# Altium project UZİNOVA_İSRA.PrjPcb
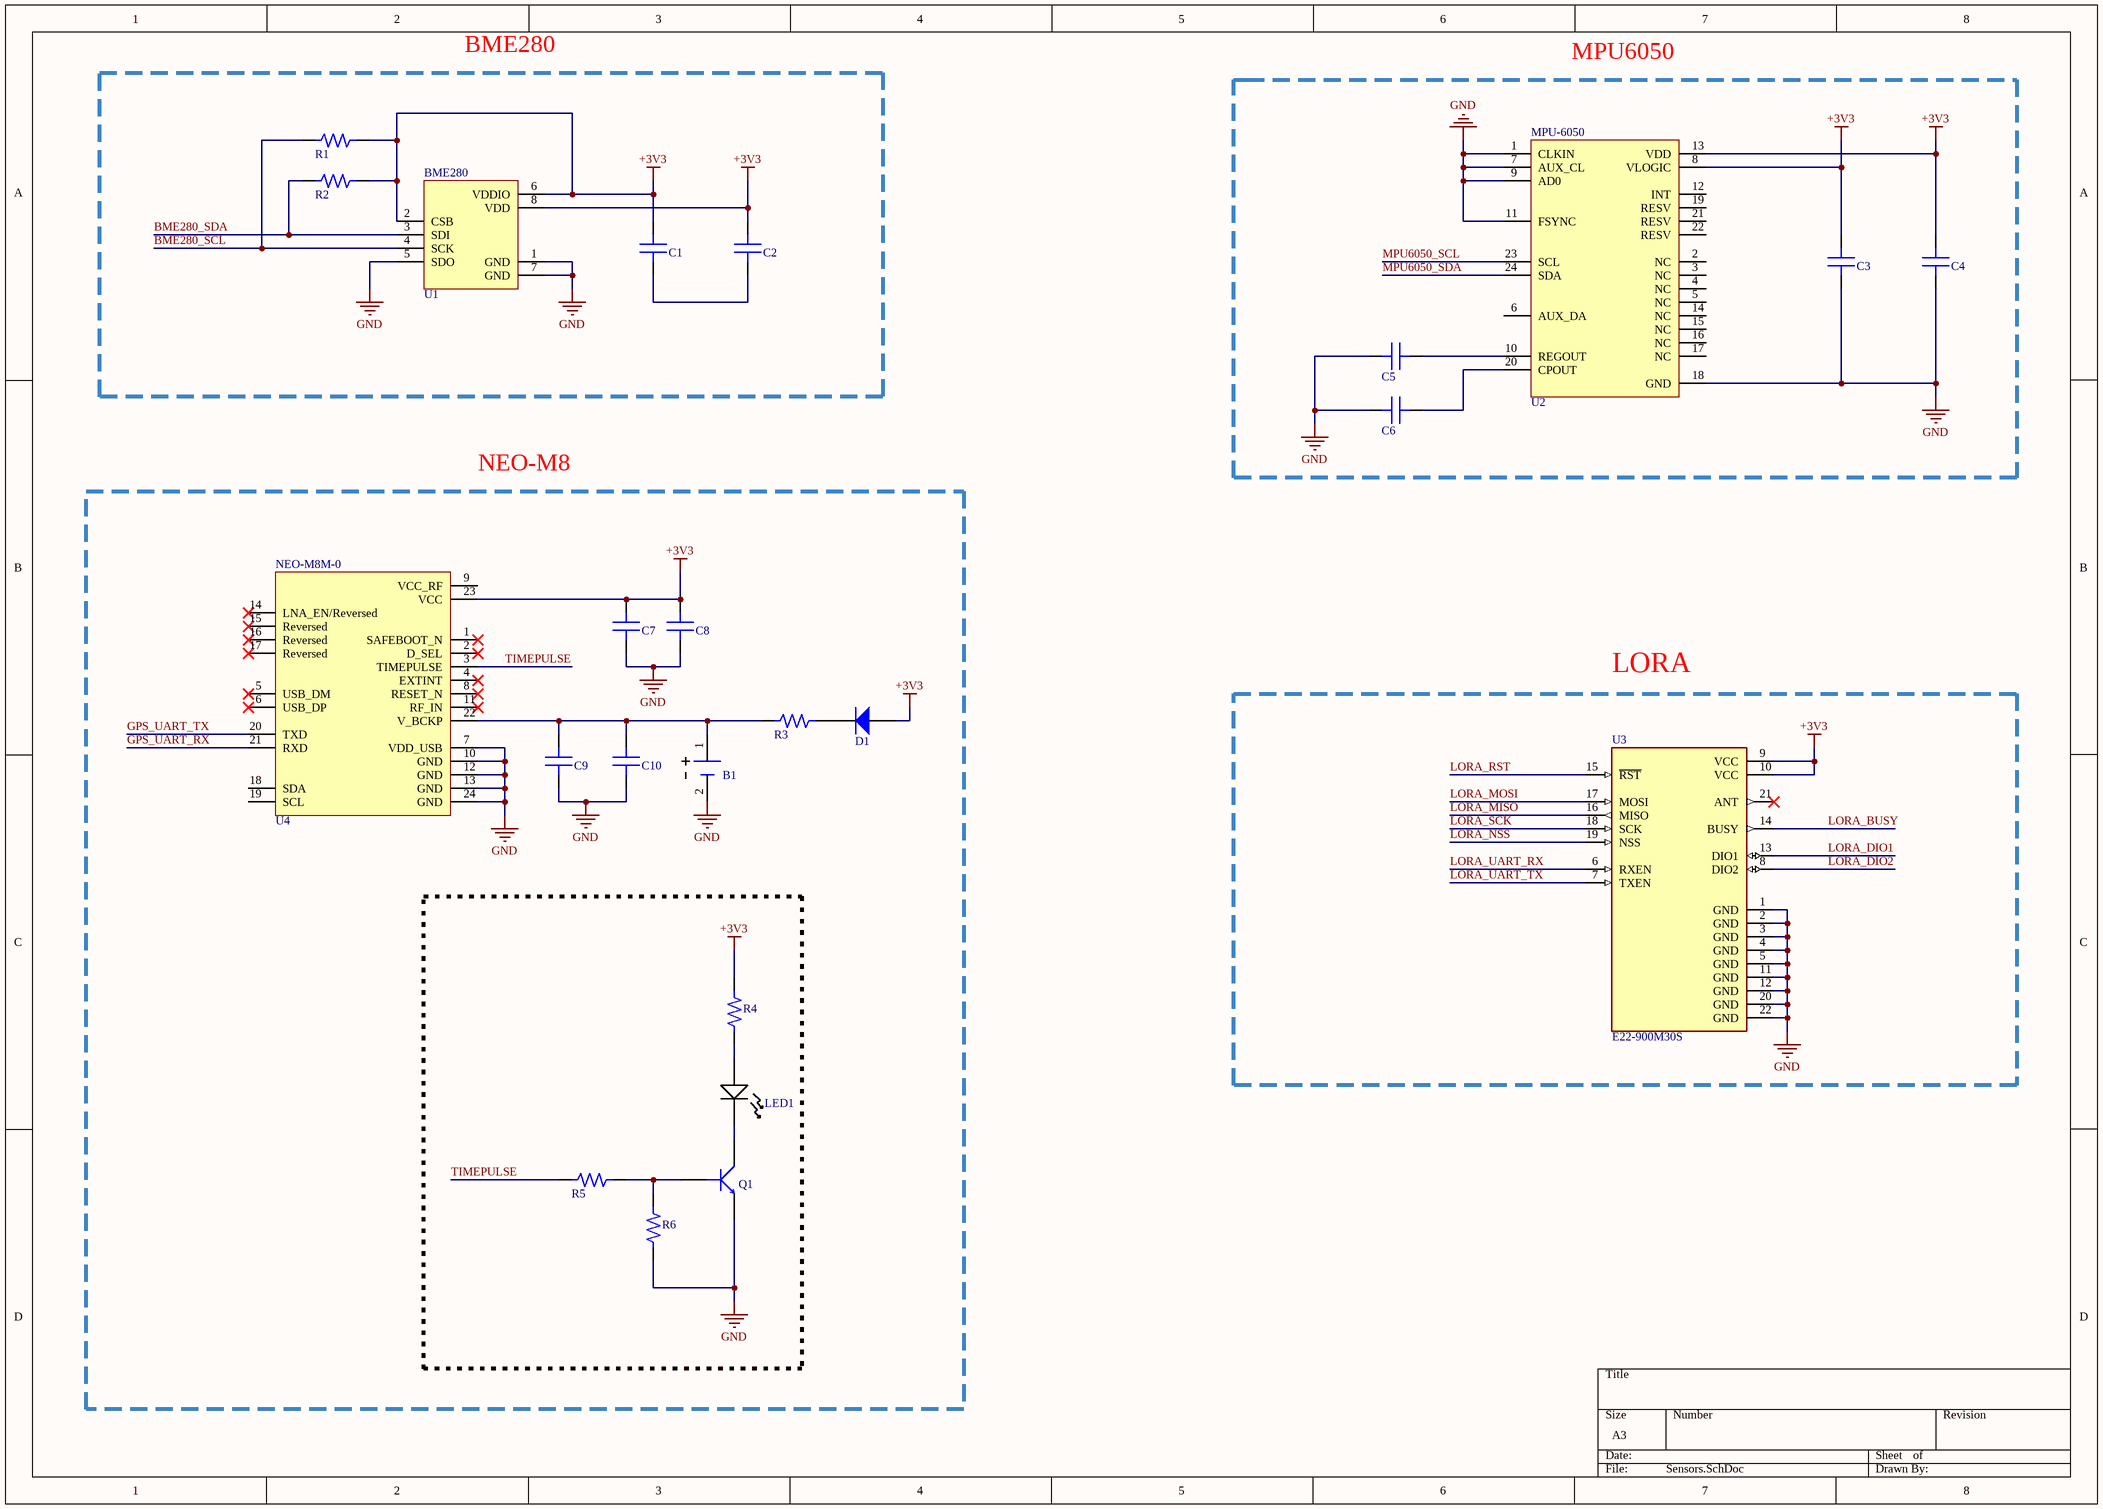
[diagram p0: Sensors.SchDoc]
3 sheets, 80 parts. Net scope: global (net labels, ports and power ports of the same name join across sheets).
Board file: İSRA.PcbDoc
Sheets:
  Sensors.SchDoc
  Mcu.SchDoc
  Power.SchDoc

## Sheet Sensors.SchDoc
size A3; SheetNumber: 1; SheetTotal: 3

### Parts
B1  MS920SE-FL27E  [MS920SE_Battery]  (value not drawn)
C1  CAP CER 100nF 0805  [CAP_0805]  (value not drawn)
C2  CAP CER 100nF 0805  [CAP_0805]  (value not drawn)
C3  CAP CER 10nF 0805  [CAP_0805]  (value not drawn)
C4  CAP CER 0.1uF 0805  [CAP_0805]  (value not drawn)
C5  CAP CER 0.1uF 0805  [CAP_0805]  (value not drawn)
C6  CAP CER 2.2nF 0805  [CAP_0805]  (value not drawn)
C7  CAP CER 10uF 0805  [CAP_0805]  (value not drawn)
C8  CAP CER 100nF 0805  [CAP_0805]  (value not drawn)
C9  CAP CER 4.7uF 0805  [CAP_0805]  (value not drawn)
C10  CAP CER 100nF 0805  [CAP_0805]  (value not drawn)
D1  DIODE GEN PURP 75V 150MA SOD323F  [SOD323F]  (value not drawn)
LED1  CMD17-21VRD/TR8  [LED RED_0805]  (value not drawn)
Q1  MMBT3904-7-F  [SOT_23F]  (value not drawn)
R1  RES 4.7K OHM 0805  [RES_0805]  (value not drawn)
R2  RES 4.7K OHM 0805  [RES_0805]  (value not drawn)
R3  RES 1K OHM 0805  [RES_0805]  (value not drawn)
R4  RES 1K OHM 0805  [RES_0805]  (value not drawn)
R5  RES 10K OHM 0805  [RES_0805]  (value not drawn)
R6  RES 10K OHM 0805  [RES_0805]  (value not drawn)
U1  BME280  [BME280]
U2  MPU-6050  [QFN-24-MPU6050]
U3  E22-900M30S  [LORA]
U4  NEO-M8M-0  [NEO-M8-GPS]

### Blocks framed on the sheet
BME280: C1 C2 R1 R2 U1
MPU6050: C3-C6 U2
NEO-M8: B1 C7-C10 D1 LED1 Q1 R3-R6 U4
LORA: U3

### Nets
+3V3: C1.2 C2.2 C3.2 C4.2 C7.2 C8.2 D1.2(ANODE) R1.2 R2.2 R4.2 U1.2(CSB) U1.6(VDDIO) U1.8(VDD) U2.8(VLOGIC) U2.13(VDD) U3.9(VCC) U3.10(VCC) U4.23(VCC)
GND: B1.2 C3.1 C4.1 C5.1 C6.1 C7.1 C8.1 C9.1 C10.1 Q1.2(E) R6.1 U1.1(GND) U1.5(SDO) U1.7(GND) U2.1(CLKIN) U2.7(AUX_CL) U2.9(AD0) U2.11(FSYNC) U2.18(GND) U3.1(GND) U3.2(GND) U3.3(GND) U3.4(GND) U3.5(GND) U3.11(GND) U3.12(GND) U3.20(GND) U3.22(GND) U4.7(VDD_USB) U4.10(GND) U4.12(GND) U4.13(GND) U4.24(GND)
BME280_SCL: R1.1 U1.4(SCK)
BME280_SDA: R2.1 U1.3(SDI)
GPS_UART_RX: U4.21(RXD)
GPS_UART_TX: U4.20(TXD)
LORA_BUSY: U3.14(BUSY)
LORA_DIO1: U3.13(DIO1)
LORA_DIO2: U3.8(DIO2)
LORA_MISO: U3.16(MISO)
LORA_MOSI: U3.17(MOSI)
LORA_NSS: U3.19(NSS)
LORA_RST: U3.15(~{RST})
LORA_SCK: U3.18(SCK)
LORA_UART_RX: U3.6(RXEN)
LORA_UART_TX: U3.7(TXEN)
MPU6050_SCL: U2.23(SCL)
MPU6050_SDA: U2.24(SDA)
TIMEPULSE: R5.1 U4.3(TIMEPULSE)
NetB1_1: B1.1 C9.2 C10.2 R3.1 U4.22(V_BCKP)
NetC1_1: C1.1 C2.1
NetC5_2: C5.2 U2.10(REGOUT)
NetC6_2: C6.2 U2.20(CPOUT)
NetD1_1: D1.1(CATHODE) R3.2
NetLED1_1: LED1.1 R4.1
NetLED1_2: LED1.2 Q1.3(C)
NetQ1_1: Q1.1(B) R5.2 R6.2

Not connected (* = marked no-connect by the designer): U2 2(NC) 3(NC) 4(NC) 5(NC) 6(AUX_DA) 12(INT) 14(NC) 15(NC) 16(NC) 17(NC) 19(RESV) 21(RESV) 22(RESV); U3 21(ANT)*; U4 1(SAFEBOOT_N)* 2(D_SEL)* 4(EXTINT)* 5(USB_DM)* 6(USB_DP)* 8(RESET_N)* 9(VCC_RF) 11(RF_IN)* 14(LNA_EN/Reversed)* 15(Reversed)* 16(Reversed)* 17(Reversed)* 18(SDA) 19(SCL)

### Notes on the sheet
- (near R1) SDO nun GND ye bağlanması sonucu slave adres 1110110(0x76) olur
- (near U4) USB İLE DEĞİL UART İLE HABERLEŞİYOR
- RF antenlerle ilgili olmalı?
- (near U4) KULLANILACAK MI ? UART İÇİN RX-TX KULLANILIYOR..
- SORU İŞARETİ???
  XBEE İŞLEMCİYE GİTMEDEN ÖNCE KONNEKTÖRE GİDECEK
  İŞLEMCİ - USB - KONNEKTÖR
  acaba xbee den çıkan rx tx pinleri usb to uart yaptığımız ch340n den çıkan rx tx pinlerine mi gidecek????
- https://image.easyeda.com/components/a3499788020748ef87e202bcfc8d7515.png

### Library data of the parts
B1 = BATTERY: Lithium Battery Coin 3V 11mAh Rechargeable Tray; Manufacturer: Epson; Capacity: 0.011ah; Number of Cells: 1; Supplier 1: Digi-Key; Manufacturer Part Number: MS920SE-FL27E; RoHS: No; Stock 1: 17863; Pricing 1: 1=2,520000, 10=2,091000, 50=1,844000, 100=1,741000, 300=1,617400, 500=1,535000, 1000=1,452580, 2500=1,380470 (USD); Mount: Screw; Min Operating Temperature: -20°C; Max Operating Temperature: 60°C; Chemistry/Technology: Lithium; Voltage: 3V; ComponentLink1URL: http://speed.sii.co.jp/data/file_PRODUCT_MASTER_50112_TITLE_IMAGESP.pdf?src-supplier=Avnet; ComponentLink1Description: http://speed.sii.co.jp/data/file_PRODUCT_MASTER_50112_TITLE_IMAGESP.pdf?src-supplier=Avnet; Supplier Part Number 1: 728-1058-ND
D1 = DIODE: VR=75V IF=150mA Trr=4ns P=200mW; Manufacturer: ON Semiconductor / Fairchild; Manufacturer Part Number: 1N4148WS; Element Configuration: Single; Reverse Recovery Time: 4ns; Forward Voltage: 1V; Max Reverse Current: 5uA; Power Dissipation: 200mW; Max Forward Surge Current (Ifsm): 2A; Supplier 1: Digi-Key; RoHS: Yes; Category: Rectifier Diodes; Stock 1: 973654; Pricing 1: 1=0,21000, 10=0,19200, 100=0,10460, 500=0,06436, 1000=0,04388 (USD); Mount: Surface Mount; Number of Pins: 2; Contact Plating: Tin,Matte; Weight: 0.0276g; Min Operating Temperature: -55°C; Max Operating Temperature: 150°C; Packaging: Tape and Reel; Forward Current: 150mA; Max Repetitive Reverse Voltage (Vrrm): 75V; Package Quantity: 1; Average Rectified Current: 150mA; Max Reverse Voltage (DC): 75V; Recovery Time: 4ns; Series: -; Reverse Voltage: 75V; Length: 1.8mm; Width: 1.35mm; Height: 1mm; Radiation Hardening: No; RoHS Compliant: Yes; Lead Free: Lead Free; Reach SVHC Compliant: Yes; ComponentLink1URL: https://datasheet.ciiva.com/30479/0900766b810e1cd3-30479206.pdf?src-supplier=Rs; ComponentLink1Description: https://datasheet.ciiva.com/30479/0900766b810e1cd3-30479206.pdf?src-supplier=Rs; ComponentLink2URL: https://datasheet.ciiva.com/15208/getdatasheetpartid-127819-15208358.pdf?src-supplier=Verical; ComponentLink2Description: https://datasheet.ciiva.com/15208/getdatasheetpartid-127819-15208358.pdf?src-supplier=Verical; ComponentLink3URL: https://datasheet.ciiva.com/8300/1n914bws-8300360.pdf?src-supplier=Avnet; ComponentLink3Description: https://datasheet.ciiva.com/8300/1n914bws-8300360.pdf?src-supplier=Avnet; ComponentLink4URL: https://datasheet.ciiva.com/910/1n4148ws-910381.pdf?src-supplier=Digi-Key; ComponentLink4Description: https://datasheet.ciiva.com/910/1n4148ws-910381.pdf?src-supplier=Digi-Key; ComponentLink5URL: https://datasheet.ciiva.com/910/1n4148ws-910382.pdf?src-supplier=Digi-Key; ComponentLink5Description: https://datasheet.ciiva.com/910/1n4148ws-910382.pdf?src-supplier=Digi-Key; ComponentLink6URL: https://datasheet.ciiva.com/910/1n4148ws-910380.pdf?src-supplier=Digi-Key; ComponentLink6Description: https://datasheet.ciiva.com/910/1n4148ws-910380.pdf?src-supplier=Digi-Key; Supplier Part Number 1: 1N4148WSFSDKR-ND
LED1 = LED RED: LED Uni-Color Red 640nm 2-Pin SMT T/R; Manufacturer: VCC CHML; Power Rating: 100mW; Luminous Intensity: 6mcd; Viewing Angle: 140°; Lens Style: Diffused,Tinted,Rectangular,Colored; Forward Current: 20mA; Forward Voltage: 2V; Reverse Voltage (DC): 5V; Number of LEDs: 1; Supplier 1: Digi-Key; Manufacturer Part Number: CMD17-21VRD/TR8; RoHS: Yes; Category: LEDs; Stock 1: 357228; Pricing 1: 1=0,73000, 10=0,47800, 100=0,31310, 1000=0,24720 (USD); Mount: Surface Mount; Case/Package: 0805; Number of Pins: 2; Color: Red; Case Code (Metric): 2012; Case Code (Imperial): 0805; Lens Color: Red; Min Operating Temperature: -40°C; Max Operating Temperature: 85°C; Packaging: Tape and Reel; Package Quantity: 1; Illumination Color: Red; Test Current: 20mA; Wavelength: 640nm; Reverse Voltage: 5V; Length: 2mm; Width: 1.25mm; Height: 1.1mm; RoHS Compliant: Yes; Lead Free: Lead Free; ComponentLink1URL: http://www.mouser.com/ds/2/423/CMD1721ver1-1064576.pdf?src-supplier=Mouser; ComponentLink1Description: http://www.mouser.com/ds/2/423/CMD1721ver1-1064576.pdf?src-supplier=Mouser; ComponentLink2URL: https://www.alliedelec.com/m/d/ea8f758becbd32522d2612194452bcae.pdf?src-supplier=Allied+Electronics; ComponentLink2Description: https://www.alliedelec.com/m/d/ea8f758becbd32522d2612194452bcae.pdf?src-supplier=Allied+Electronics; ComponentLink3URL: http://www.onlinecomponents.com/productFiles/mf-CM/2cmd17-21seriessmtleds0805packagesize.pdf?src-supplier=Onlinecomponents.com; ComponentLink3Description: http://www.onlinecomponents.com/productFiles/mf-CM/2cmd17-21seriessmtleds0805packagesize.pdf?src-supplier=Onlinecomponents.com; ComponentLink4URL: https://vcclite.com/wp-content/uploads/wpallimport/files/files/CMD1721Seriesver3.pdf?src-supplier=Digi-Key; ComponentLink4Description: https://vcclite.com/wp-content/uploads/wpallimport/files/files/CMD1721Seriesver3.pdf?src-supplier=Digi-Key; Supplier Part Number 1: L62501CT-ND
Q1 = BJT_NPN: NPN Ic=200mA Vceo=40V hfe=100~300 fT=310MHz P=300mW SOT-23; Manufacturer: Diodes Zetex; Max Power Dissipation: 300mW; Collector Emitter Voltage (VCEO): 40V; Max Collector Current: 200mA; Collector Base Voltage (VCBO): 60V; Power Dissipation: 350mW; Frequency: 300MHz; hFE Min: 100; Number of Elements: 1; Emitter Base Voltage (VEBO): 6V; Collector Emitter Saturation Voltage: 300mV; Element Configuration: Single; Supplier 1: Digi-Key; Manufacturer Part Number: MMBT3904-7-F; RoHS: Yes; Category: BJTs; Stock 1: 7729144; Pricing 1: 1=0,13000, 10=0,11700, 100=0,06370, 500=0,03918, 1000=0,02671 (USD); Mount: Surface Mount; Case/Package: SOT-23; Number of Pins: 3; Weight: 0.000282oz; Contact Plating: Tin,Matte; Min Operating Temperature: -55°C; Max Operating Temperature: 150°C; Polarity: NPN; Packaging: Tape and Reel; Package Quantity: 3000; Transition Frequency: 300MHz; Collector Emitter Breakdown Voltage: 40V; Max Breakdown Voltage: 40V; Continuous Collector Current: 200mA; Max Frequency: 300MHz; Gain Bandwidth Product: 300MHz; Voltage Rating (DC): 40V; Series: Automotive, AEC-Q101; Collector-emitter Voltage-Max: 300mV; Length: 3.05mm; Width: 1.4mm; Height: 1mm; Radiation Hardening: No; Reach SVHC Compliant: Yes; Lead Free: Lead Free; RoHS Compliant: Yes; ComponentLink1URL: https://datasheet.ciiva.com/11201/ds30036-11201778.pdf?src-supplier=Avnet; ComponentLink1Description: https://datasheet.ciiva.com/11201/ds30036-11201778.pdf?src-supplier=Avnet; ComponentLink2URL: https://datasheet.ciiva.com/15138/getdatasheetpartid-53265-15138780.pdf?src-supplier=Verical; ComponentLink2Description: https://datasheet.ciiva.com/15138/getdatasheetpartid-53265-15138780.pdf?src-supplier=Verical; ComponentLink3URL: https://datasheet.ciiva.com/22711/1915516-22711750.pdf?src-supplier=Element14; ComponentLink3Description: https://datasheet.ciiva.com/22711/1915516-22711750.pdf?src-supplier=Element14; ComponentLink4URL: https://datasheet.ciiva.com/11198/ds30036-11198999.pdf?src-supplier=Avnet; ComponentLink4Description: https://datasheet.ciiva.com/11198/ds30036-11198999.pdf?src-supplier=Avnet; ComponentLink5URL: https://datasheet.ciiva.com/6361/ds30036-6361256.pdf?src-supplier=Digi-Key; ComponentLink5Description: https://datasheet.ciiva.com/6361/ds30036-6361256.pdf?src-supplier=Digi-Key; ComponentLink6URL: https://datasheet.ciiva.com/6361/ds30036-6361254.pdf?src-supplier=Digi-Key; ComponentLink6Description: https://datasheet.ciiva.com/6361/ds30036-6361254.pdf?src-supplier=Digi-Key; Supplier Part Number 1: MMBT3904-FDICT-ND
U1 = BME280: Pressure, Temperature and Humidity Sensor Digital Output 1.8V 8-Pin LGA T/R; Manufacturer: Bosch Tools; Supplier 1: Digi-Key; Manufacturer Part Number: BME280; RoHS: No; Category: Pressure Sensors; Stock 1: 180730; Pricing 1: 1=7,64000, 5=6,74200, 10=5,95500, 25=4,83160, 50=4,26960, 100=4,15730, 500=3,48316, 1000=3,25844 (USD); Supplier Part Number 1: 828-1063-1-ND
U2 = MPU6050: IMU ACCEL/GYRO 3-AXIS I2C 24QFN; Manufacturer: TDK InvenSense; Sensor Type: Accelerometer,Gyroscope,6 Axis; Supplier 1: Digi-Key; Manufacturer Part Number: MPU-6050; RoHS: Yes; Category: Inertial Measurement Units (IMUs); Pricing 1: 1=9,11000, 5=7,99200, 10=7,19300, 25=6,39400, 50=5,91440, 100=5,11520, 500=4,79550, 1000=4,47580 (USD); Mount: Surface Mount; Case/Package: QFN; Min Operating Temperature: -40°C; Max Operating Temperature: 85°C; Packaging: Cut Tape; Output Type: I2C; Series: -; RoHS Compliant: Yes; ComponentLink1URL: https://datasheet.ciiva.com/1513/1788002-1513632.pdf?src-supplier=Element14; ComponentLink1Description: https://datasheet.ciiva.com/1513/1788002-1513632.pdf?src-supplier=Element14; ComponentLink2URL: https://datasheet.ciiva.com/22731/1788002-22731434.pdf?src-supplier=Element14; ComponentLink2Description: https://datasheet.ciiva.com/22731/1788002-22731434.pdf?src-supplier=Element14; Supplier Part Number 1: 1428-1007-1-ND
U3 = LORA: SX1262 868/915 MHz 1w SPI LoRa Module; MF: EBYTE; Value: *; SnapEDA_Link: https://www.snapeda.com/parts/E22-900M30S/EBYTE/view-part/?ref=snap; Availability: Not in stock; Price: None; Check_prices: https://www.snapeda.com/parts/E22-900M30S/EBYTE/view-part/?ref=eda; Package: Package; MP: E22-900M30S
U4 = NEO-M8: Rf Rcvr Gnss/gps 1.575GHZ 24LCC; Manufacturer: u-blox; Interface: I2C,SPI,USB,UART; Sensitivity: -167dBm; Current - Receiving: 21mA; Supplier 1: Digi-Key; Manufacturer Part Number: NEO-M8M-0; RoHS: Yes; Category: RF Receivers, Transceivers; Stock 1: 3000; Pricing 1: 1=27,00000, 10=19,61000, 50=16,10000, 100=12,89000 (USD); Case/Package: SMD/SMT; Min Operating Temperature: -40°C; Max Operating Temperature: 85°C; Packaging: Tape and Reel; Frequency: 1.575GHz; ComponentLink1URL: https://www.u-blox.com/sites/default/files/products/documents/NEO-M8-FW3_ProductSummary_%28UBX-16000345%29.pdf?src-supplier=Digi-Key; ComponentLink1Description: https://www.u-blox.com/sites/default/files/products/documents/NEO-M8-FW3_ProductSummary_%28UBX-16000345%29.pdf?src-supplier=Digi-Key; ComponentLink2URL: https://www.u-blox.com/sites/default/files/NEO-M8-FW3_DataSheet_%28UBX-15031086%29.pdf?src-supplier=Digi-Key; ComponentLink2Description: https://www.u-blox.com/sites/default/files/NEO-M8-FW3_DataSheet_%28UBX-15031086%29.pdf?src-supplier=Digi-Key; Supplier Part Number 1: 672-NEO-M8M-0CT-ND

## Sheet Mcu.SchDoc
size A3; SheetNumber: 2; SheetTotal: 3
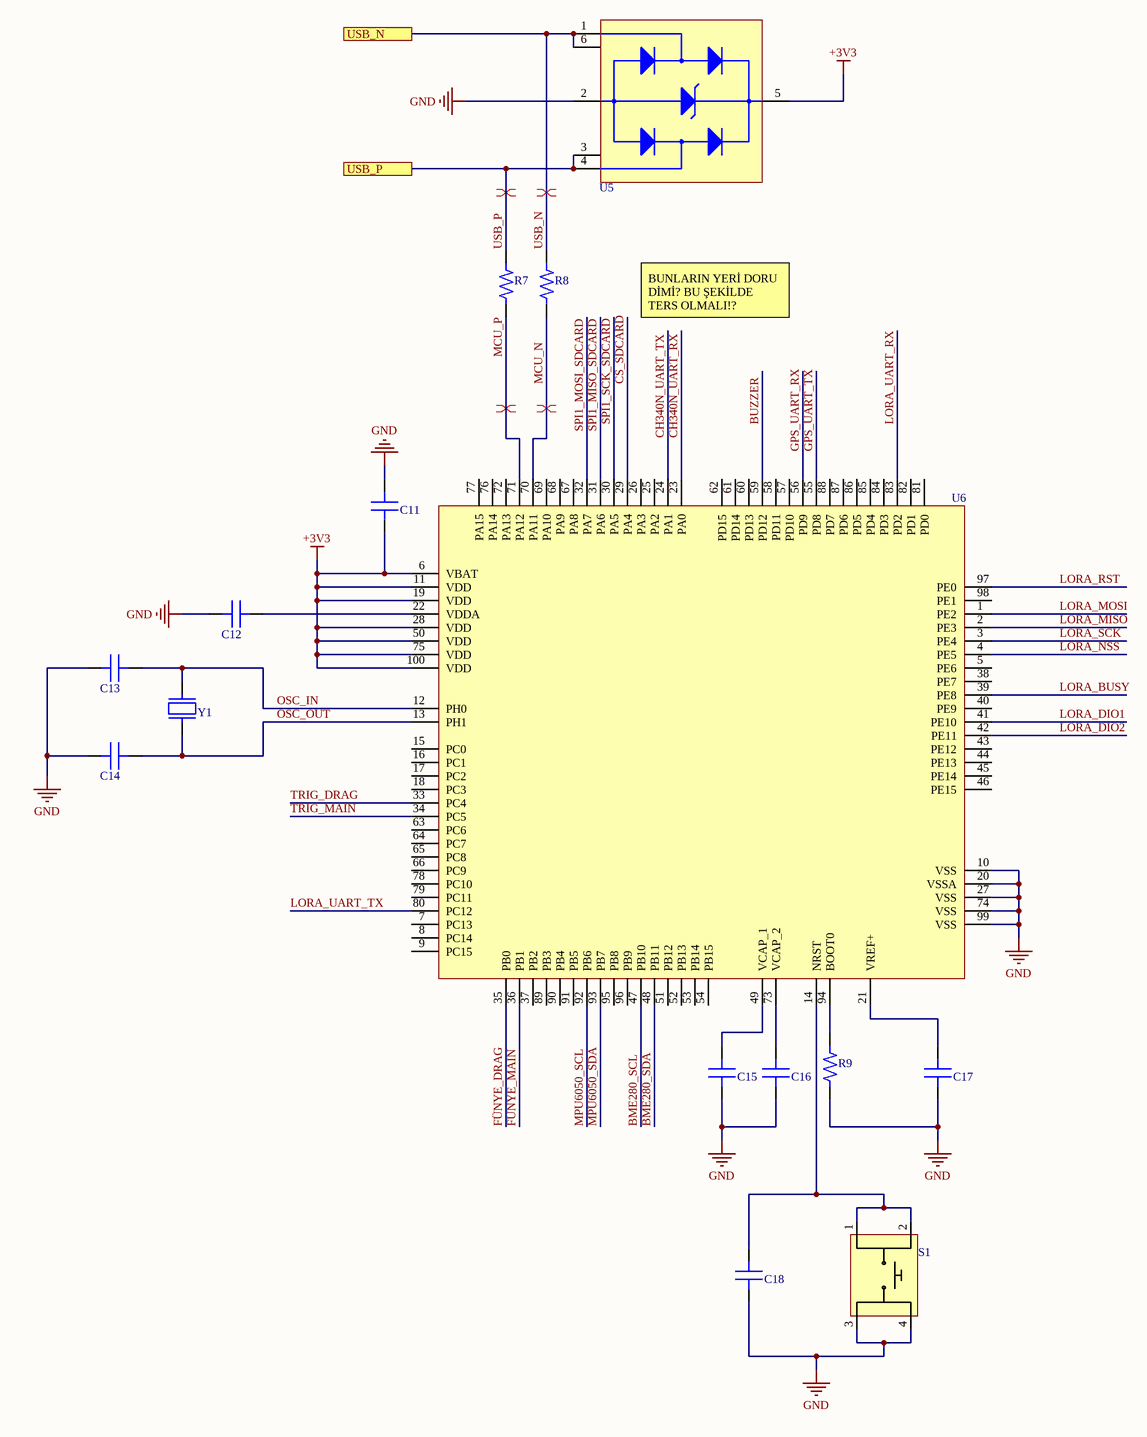
[diagram p1: Mcu.SchDoc]

### Parts
C11  CAP CER 1uF 0805  [CAP_0805]  (value not drawn)
C12  CAP CER 10nF 0805  [CAP_0805]  (value not drawn)
C13  CAP CER 20pF 0805  [CAP_0805]  (value not drawn)
C14  CAP CER 20pF 0805  [CAP_0805]  (value not drawn)
C15  CAP CER 2.2uF 0805  [CAP_0805]  (value not drawn)
C16  CAP CER 2.2uF 0805  [CAP_0805]  (value not drawn)
C17  CAP CER 10nF 0805  [CAP_0805]  (value not drawn)
C18  CAP CER 0.1uF 0805  [CAP_0805]  (value not drawn)
R7  RES 15 OHM 0805  [RES_0805]  (value not drawn)
R8  RES 15 OHM 0805  [RES_0805]  (value not drawn)
R9  RES 10K OHM 0805  [RES_0805]  (value not drawn)
S1  PTS815 SJG 250 SMTR LFS  [BUTTON]  (value not drawn)
U5  USBLC6-2SC6  [SOT-23-6L]  (value not drawn)
U6  STM32F407VGT6  [LQFP-100]  (value not drawn)
Y1  CRYSTAL 32.7680KHZ 12.5PF SMD  [CRYSTAL_ABS05]  (value not drawn)

### Ports
USB_N, USB_P

### Nets
+3V3: C11.1 U5.5(VBUS) U6.6(VBAT) U6.11(VDD) U6.19(VDD) U6.28(VDD) U6.50(VDD) U6.75(VDD) U6.100(VDD)
GND: C11.2 C12.1 C13.1 C14.1 C15.1 C16.1 C17.1 C18.1 R9.1 S1.3 S1.4 U5.2(GND) U6.10(VSS) U6.20(VSSA) U6.27(VSS) U6.74(VSS) U6.99(VSS)
BME280_SCL: U6.47(PB10)
BME280_SDA: U6.48(PB11)
BUZZER: U6.59(PD12)
CH340N_UART_RX: U6.23(PA0)
CH340N_UART_TX: U6.24(PA1)
CS_SDCARD: U6.29(PA4)
FÜNYE_DRAG: U6.35(PB0)
FÜNYE_MAIN: U6.36(PB1)
GPS_UART_RX: U6.56(PD9)
GPS_UART_TX: U6.55(PD8)
LORA_BUSY: U6.39(PE8)
LORA_DIO1: U6.41(PE10)
LORA_DIO2: U6.42(PE11)
LORA_MISO: U6.2(PE3)
LORA_MOSI: U6.1(PE2)
LORA_NSS: U6.4(PE5)
LORA_RST: U6.97(PE0)
LORA_SCK: U6.3(PE4)
LORA_UART_RX: U6.83(PD2)
LORA_UART_TX: U6.80(PC12)
MCU_N: R8.1 U6.70(PA11)
MCU_P: R7.1 U6.71(PA12)
MPU6050_SCL: U6.92(PB6)
MPU6050_SDA: U6.93(PB7)
OSC_IN: C13.2 U6.12(PH0) Y1.2
OSC_OUT: C14.2 U6.13(PH1) Y1.1
SPI1_MISO_SDCARD: U6.31(PA6)
SPI1_MOSI_SDCARD: U6.32(PA7)
SPI1_SCK_SDCARD: U6.30(PA5)
TRIG_DRAG: U6.33(PC4)
TRIG_MAIN: U6.34(PC5)
USB_N: R8.2 U5.1(I/O1_IN) U5.6(I/O1_OUT) ; port USB_N
USB_P: R7.2 U5.3(I/O2_IN) U5.4(I/O2_OUT) ; port USB_P
NetC12_2: C12.2 U6.22(VDDA)
NetC15_2: C15.2 U6.49(VCAP_1)
NetC16_2: C16.2 U6.73(VCAP_2)
NetC17_2: C17.2 U6.21(VREF+)
NetC18_2: C18.2 S1.1 S1.2 U6.14(NRST)
NetR9_2: R9.2 U6.94(BOOT0)

Not connected (* = marked no-connect by the designer): U6 5(PE6) 7(PC13) 8(PC14) 9(PC15) 15(PC0) 16(PC1) 17(PC2) 18(PC3) 25(PA2) 26(PA3) 37(PB2) 38(PE7) 40(PE9) 43(PE12) 44(PE13) 45(PE14) 46(PE15) 51(PB12) 52(PB13) 53(PB14) 54(PB15) 57(PD10) 58(PD11) 60(PD13) 61(PD14) 62(PD15) 63(PC6) 64(PC7) 65(PC8) 66(PC9) 67(PA8) 68(PA9) 69(PA10) 72(PA13) 76(PA14) 77(PA15) 78(PC10) 79(PC11) 81(PD0) 82(PD1) 84(PD3) 85(PD4) 86(PD5) 87(PD6) 88(PD7) 89(PB3) 90(PB4) 91(PB5) 95(PB8) 96(PB9) 98(PE1)

### Layout directives
differential pair: MCU_N, MCU_P, USB_N, USB_P

### Notes on the sheet
- BUNLARIN YERİ DORU DİMİ? BU ŞEKİLDE TERS OLMALI!?
- - The high-speed external (HSE) clock can be supplied with a 4 to 26 MHz crystal/ceramic
  resonator oscillator.
  - For CL1 and CL2, it is recommended to use high-quality external ceramic capacitors in the
  5 pF to 25 pF range. CL1 and CL2 are usually the
  same size. (Ben 20pF seçtim)
- (near C17) BOOT0 ekleme yapılabilir-amerika roket

### Library data of the parts
S1 = BUTTON: Switch Tactile N.O. SPST Button J-Bend 0.05A 12VDC 3.92N SMD T/R; Manufacturer: ITT C&K; Supplier 1: Digi-Key; Manufacturer Part Number: PTS815SJG250SMTRLFS; RoHS: Yes; Category: Tactile Switches; Stock 1: 47215; Pricing 1: 1=0,22000, 10=0,21400, 25=0,20280, 100=0,18360, 250=0,16736, 500=0,15558, 1000=0,13271 (USD); Supplier Part Number 1: CKN12217-1-ND
U5 = USB PROTECTION: TVS DIODE 5.25VWM 17VC SOT23-6; Manufacturer: STMicroelectronics; Direction: Unidirectional,Bidirectional; Capacitance: 3.5pF; Operating Supply Voltage: 1.1V; Number of Channels: 2; Breakdown Voltage: 6V; Clamping Voltage: 17V; Reverse Standoff Voltage: 5.25V; Power Line Protection: Yes; Test Current: 1mA; Max Reverse Leakage Current: 150nA; Peak Pulse Current: 5A; Element Configuration: Dual; Data Rate: 480Mbps; Number of Elements: 1; Working Voltage: 5V; Supplier 1: Digi-Key; Manufacturer Part Number: USBLC6-2SC6; RoHS: Yes; Category: TVS Diodes; Stock 1: 127716; Pricing 1: 1=0,61000, 10=0,52200, 100=0,38970, 500=0,30620, 1000=0,23660 (USD); Mount: Surface Mount; Case/Package: SOT-23; Number of Pins: 6; Contact Plating: Tin,Matte; Min Operating Temperature: -40°C; Max Operating Temperature: 125°C; Packaging: Tape and Reel; Package Quantity: 3000; Termination: SMD/SMT; Number of Bidirectional Channels: 2; Min Breakdown Voltage: 6V; ESD Protection: Yes; Leakage Current: 150nA; Series: USB; Reverse Breakdown Voltage: 6V; Polarity: Unidirectional,Bidirectional; Max Breakdown Voltage: 6V; Clamping Voltage-Max: 17V; Length: 3.05mm; Width: 1.75mm; Height: 1.3mm; Depth: 1.75mm; Radiation Hardening: No; Reach SVHC Compliant: Yes; Lead Free: Lead Free; RoHS Compliant: Yes; ComponentLink1URL: https://datasheet.ciiva.com/1268/1690354-1268384.pdf?src-supplier=Element14; ComponentLink1Description: https://datasheet.ciiva.com/1268/1690354-1268384.pdf?src-supplier=Element14; ComponentLink2URL: https://datasheet.ciiva.com/4508/cd00050750-113117-4508433.pdf?src-supplier=Mouser; ComponentLink2Description: https://datasheet.ciiva.com/4508/cd00050750-113117-4508433.pdf?src-supplier=Mouser; ComponentLink3URL: https://datasheet.ciiva.com/15143/getdatasheetpartid-148465-15143789.pdf?src-supplier=Verical; ComponentLink3Description: https://datasheet.ciiva.com/15143/getdatasheetpartid-148465-15143789.pdf?src-supplier=Verical; ComponentLink4URL: https://datasheet.ciiva.com/16200/cd00050750-16200026.pdf?src-supplier=Future+Electronics; ComponentLink4Description: https://datasheet.ciiva.com/16200/cd00050750-16200026.pdf?src-supplier=Future+Electronics; ComponentLink5URL: https://datasheet.ciiva.com/41444/001184109-da-01-en-ic-esd-protecti-usblc6-2sc6-sot-23-6-stm-41444156.pdf?src-supplier=Conrad; ComponentLink5Description: https://datasheet.ciiva.com/41444/001184109-da-01-en-ic-esd-protecti-usblc6-2sc6-sot-23-6-stm-41444156.pdf?src-supplier=Conrad; Supplier Part Number 1: 497-5235-1-ND
U6 = STM32F407VGT6: IC MCU 32BIT 1MB FLASH 100LQFP; Manufacturer: STMicroelectronics; Core Architecture: ARM; Interface: I2C,SPI,USB,CAN,Ethernet,IrDA,UART,USART,LIN,EBI/EMI,I2S; Data Bus Width: 32b; Max Supply Voltage: 3.6V; Min Supply Voltage: 1.8V; Number of I/Os: 82; Frequency: 168MHz; RAM Size: 196KB; Oscillator Type: Internal; Memory Size: 1024KB; Peripherals: Brown-out Detect/Reset,POR,PWM,WDT,DMA,LCD,I2C; Number of Timers/Counters: 14; Watchdog Timer: Yes; Number of ADC Channels: 16; Number of PWM Channels: 2; Number of SPI Channels: 3; Number of Ethernet Channels: 1; Supplier 1: Digi-Key; Manufacturer Part Number: STM32F407VGT6; RoHS: Yes; Category: Microcontrollers; Pricing 1: 1=16,52000, 10=15,18400, 25=14,55440, 90=12,82367, 270=12,19433, 450=11,40760 (USD); Case/Package: LQFP; Number of Pins: 100; Min Operating Temperature: -40°C; Max Operating Temperature: 85°C; Series: STM32 F4; Package Quantity: 90; Packaging: Tray; Max Frequency: 168MHz; Memory Type: FLASH; Number of Programmable I/O: 82; Number of I2C Channels: 3; Number of UART Channels: 2; Address Bus Width: 32b; Length: 14.2mm; Width: 14.2mm; Height: 1.45mm; Radiation Hardening: No; Reach SVHC Compliant: Yes; Lead Free: Lead Free; RoHS Compliant: Yes; ComponentLink1URL: https://datasheet.ciiva.com/14132/stm32f407vgt6-tds-eng-14132567.pdf?src-supplier=Distrelec; ComponentLink1Description: https://datasheet.ciiva.com/14132/stm32f407vgt6-tds-eng-14132567.pdf?src-supplier=Distrelec; ComponentLink2URL: https://datasheet.ciiva.com/4842/dm00037051-492832-4842280.pdf?src-supplier=Mouser; ComponentLink2Description: https://datasheet.ciiva.com/4842/dm00037051-492832-4842280.pdf?src-supplier=Mouser; ComponentLink3URL: https://datasheet.ciiva.com/48687/001075599-da-01-en-mcu-32bt-1mb-stm32f407vgt6-lqfp-100-stm-48687547.pdf?src-supplier=Conrad; ComponentLink3Description: https://datasheet.ciiva.com/48687/001075599-da-01-en-mcu-32bt-1mb-stm32f407vgt6-lqfp-100-stm-48687547.pdf?src-supplier=Conrad; Supplier Part Number 1: 497-11605-ND
Y1 = CRYSTAL: Crystal 0.032768MHz ±20ppm (Tol) 12.5pF Flexural 90000Ohm 2-Pin CSMD T/R; Manufacturer: Abracon; Manufacturer Part Number: ABS05-32.768KHZ-T; Frequency: 32.768kHz; ESR (Equivalent Series Resistance): 90kR; Operating Frequency: 32.768 kHz; Supplier 1: Digi-Key; RoHS: Yes; Category: Crystals; Stock 1: 376220; Pricing 1: 1=0,66000, 10=0,58100, 50=0,54340, 100=0,48020, 500=0,45494, 1000=0,37911 (USD); Mount: Surface Mount; Case/Package: CSMD; Number of Pins: 2; Min Operating Temperature: -40°C; Max Operating Temperature: 85°C; Packaging: Tape and Reel; Frequency Tolerance: 20ppm; Load Capacitance: 12.5pF; Package Quantity: 3000; Tolerance: 20ppm; Termination: SMD/SMT; Series Resistance: 90kR; Series: ABS05; Length: 1.6mm; Width: 1mm; Height: 0.5mm; Depth: 1mm; Radiation Hardening: No; Reach SVHC Compliant: Yes; Lead Free: Lead Free; RoHS Compliant: Yes; ComponentLink1URL: https://datasheet.ciiva.com/23810/abs05-23810480.pdf?src-supplier=Newark; ComponentLink1Description: https://datasheet.ciiva.com/23810/abs05-23810480.pdf?src-supplier=Newark; ComponentLink2URL: https://datasheet.ciiva.com/6728/abs05-6728949.pdf?src-supplier=Digi-Key; ComponentLink2Description: https://datasheet.ciiva.com/6728/abs05-6728949.pdf?src-supplier=Digi-Key; ComponentLink3URL: https://datasheet.ciiva.com/6728/abs05-6728950.pdf?src-supplier=Digi-Key; ComponentLink3Description: https://datasheet.ciiva.com/6728/abs05-6728950.pdf?src-supplier=Digi-Key; ComponentLink4URL: https://datasheet.ciiva.com/16411/abs05-16411149.pdf?src-supplier=Future+Electronics; ComponentLink4Description: https://datasheet.ciiva.com/16411/abs05-16411149.pdf?src-supplier=Future+Electronics; Supplier Part Number 1: 535-11899-1-ND

## Sheet Power.SchDoc
size A3; SheetNumber: 3; SheetTotal: 3
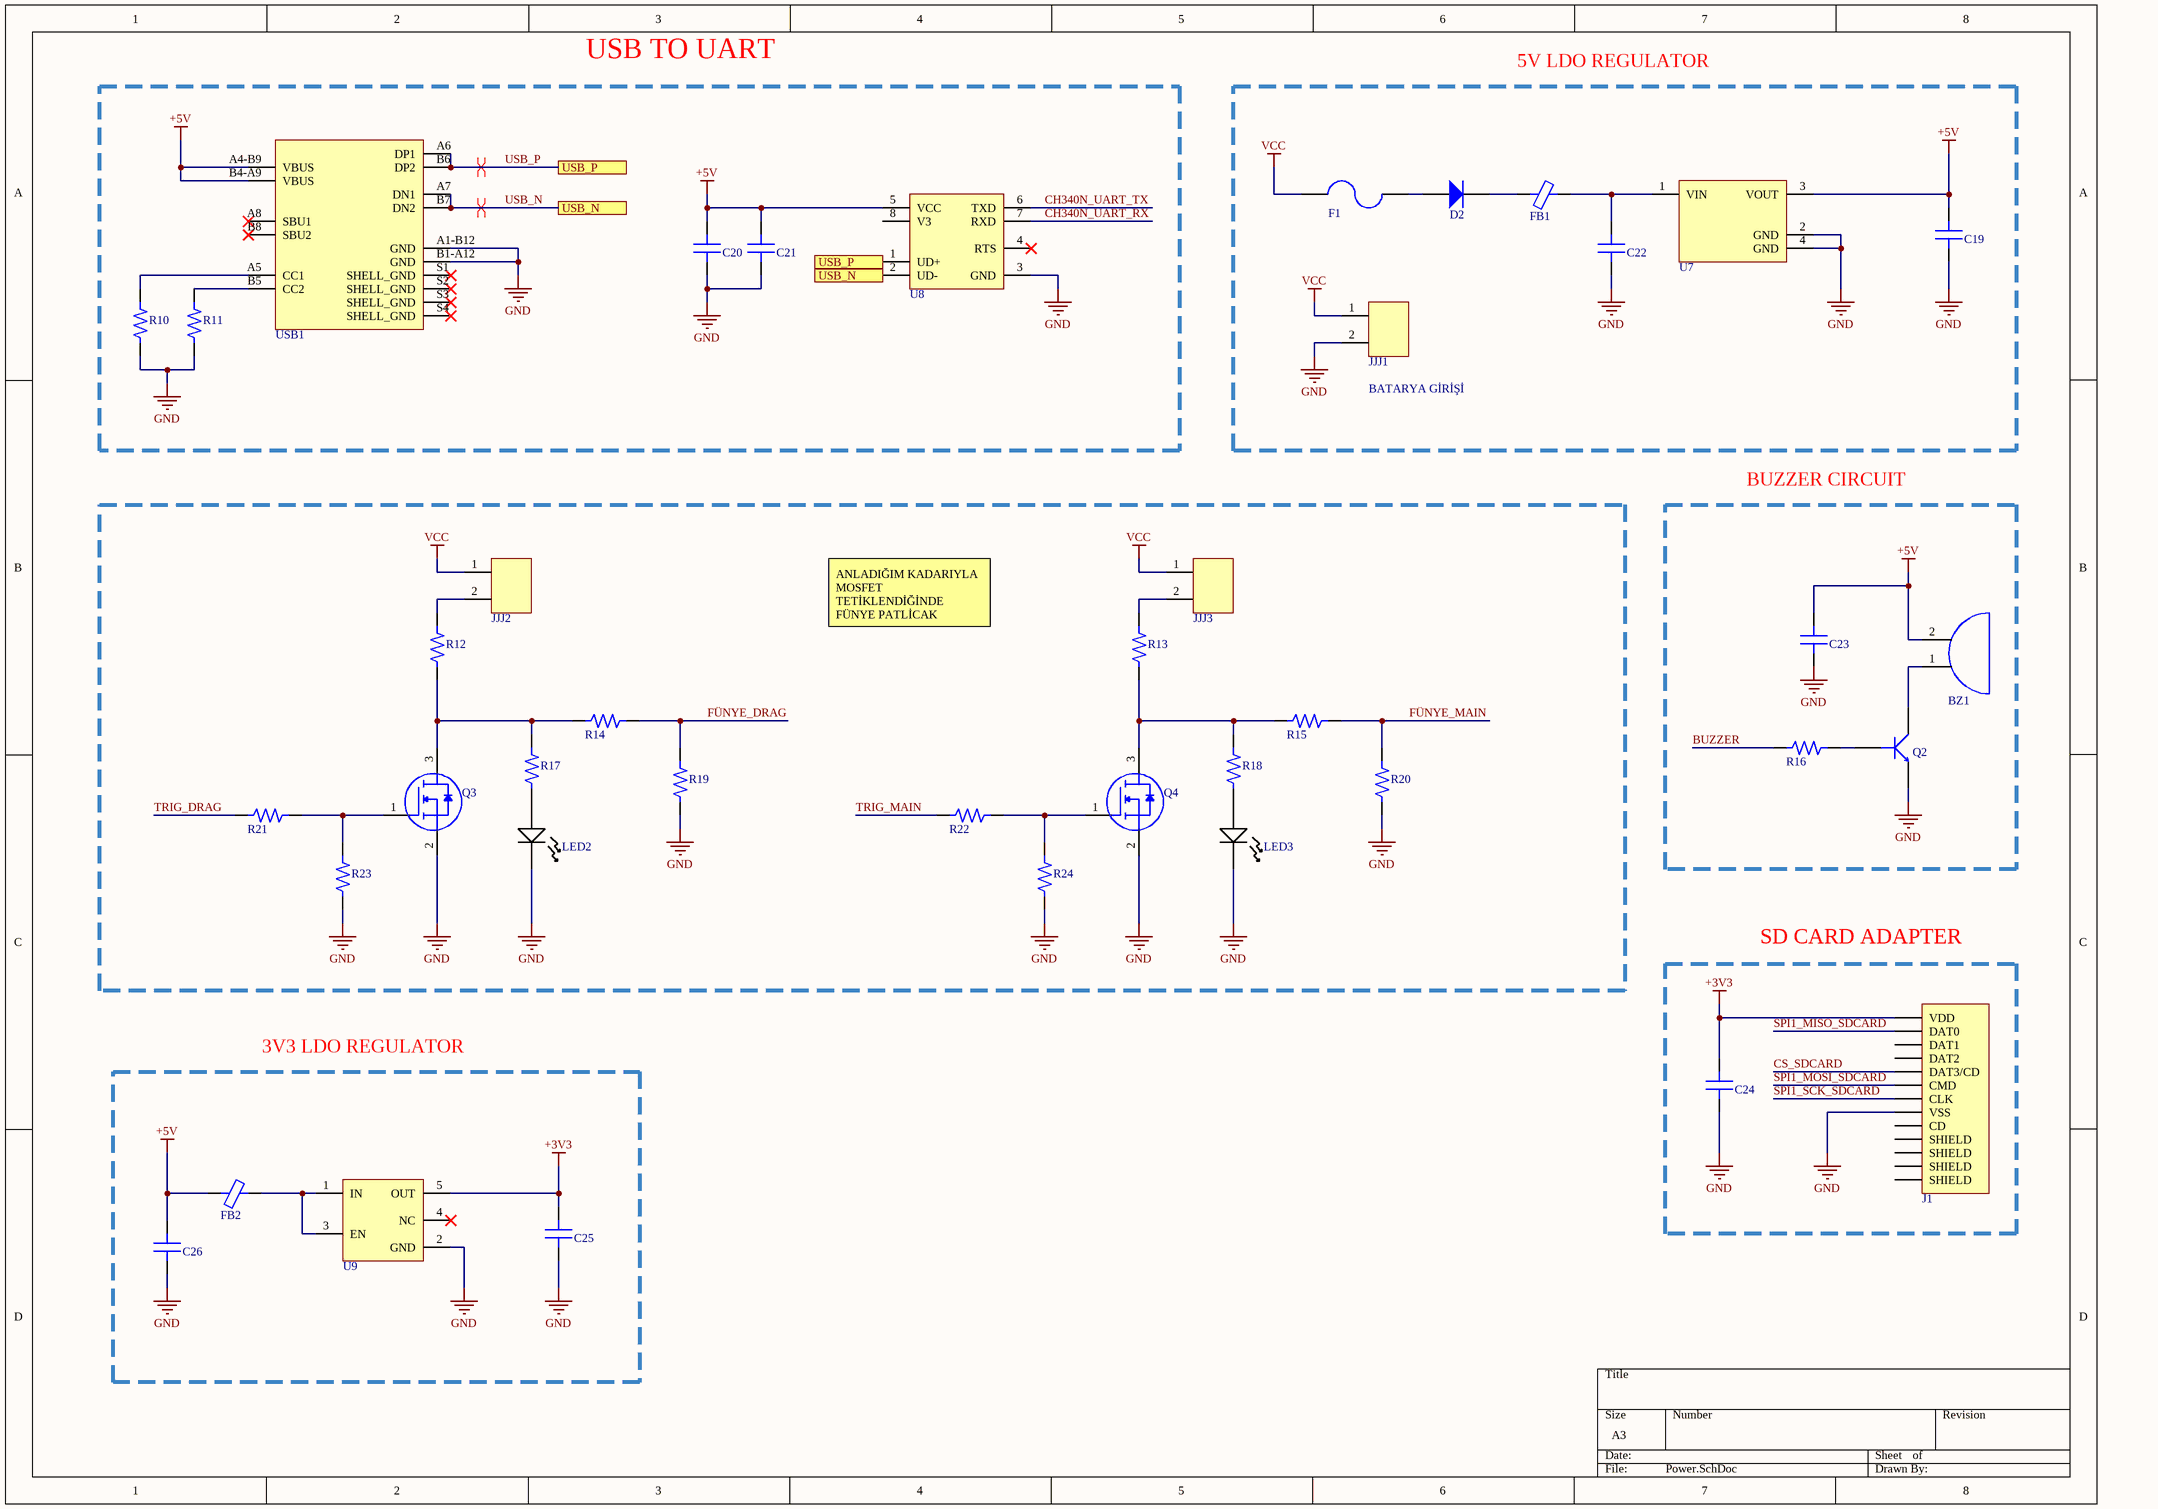
[diagram p2: Power.SchDoc]

### Parts
BZ1  CMI-9605IC-0580T  [BUZZER]  (value not drawn)
C19  CAP CER 10uF 0805  [CAP_0805]  (value not drawn)
C20  CAP CER 100nF 0805  [CAP_0805]  (value not drawn)
C21  CAP CER 100nF 0805  [CAP_0805]  (value not drawn)
C22  CAP CER 10uF 0805  [CAP_0805]  (value not drawn)
C23  CAP CER 100nF 0805  [CAP_0805]  (value not drawn)
C24  CAP CER 100nF 0805  [CAP_0805]  (value not drawn)
C25  CAP CER 1uF 0805  [CAP_0805]  (value not drawn)
C26  CAP CER 1uF 0805  [CAP_0805]  (value not drawn)
D2  DIODE GEN PURP 75V 150MA SOD323F  [SOD323F]  (value not drawn)
F1  FUSE 3413.0216.22  [FUSE_1206]  (value not drawn)
FB1  MPZ2012S601AT000  [FERRITE BEAD_0805]  (value not drawn)
FB2  MPZ2012S601AT000  [FERRITE BEAD_0805]  (value not drawn)
J1  MEM2075-00-140-01-A  [SD CARD]  (value not drawn)
JJJ1  HEADER x2  [HEADER x2]  (value not drawn)
JJJ2  HEADER x2  [HEADER x2]  (value not drawn)
JJJ3  HEADER x2  [HEADER x2]  (value not drawn)
LED2  CMD17-21VRD/TR8  [LED RED_0805]  (value not drawn)
LED3  CMD17-21VRD/TR8  [LED RED_0805]  (value not drawn)
Q2  MMBT3904-7-F  [SOT_23F]  (value not drawn)
Q3  NTR5103NT1G  [SOT-23-3]  (value not drawn)
Q4  NTR5103NT1G  [SOT-23-3]  (value not drawn)
R10  RES 10K OHM 0805  [RES_0805]  (value not drawn)
R11  RES 10K OHM 0805  [RES_0805]  (value not drawn)
R12  RES 0 OHM 0805  [RES_0805]  (value not drawn)
R13  RES 0 OHM 0805  [RES_0805]  (value not drawn)
R14  RES 20K OHM 0805  [RES_0805]  (value not drawn)
R15  RES 20K OHM 0805  [RES_0805]  (value not drawn)
R16  RES 100 OHM 0805  [RES_0805]  (value not drawn)
R17  RES 470 OHM 0805  [RES_0805]  (value not drawn)
R18  RES 470 OHM 0805  [RES_0805]  (value not drawn)
R19  RES 10K OHM 0805  [RES_0805]  (value not drawn)
R20  RES 10K OHM 0805  [RES_0805]  (value not drawn)
R21  RES 1K OHM 0805  [RES_0805]  (value not drawn)
R22  RES 1K OHM 0805  [RES_0805]  (value not drawn)
R23  RES 10K OHM 0805  [RES_0805]  (value not drawn)
R24  RES 10K OHM 0805  [RES_0805]  (value not drawn)
U7  MCP1825S-5002E/DB  [SOT-223-3]  (value not drawn)
U8  CH340N  [SOP-8]  (value not drawn)
U9  NCP161ASN330T1G  [SOT-23-5]  (value not drawn)
USB1  USB4125-GF-A  [USB4125-GF-A / Type C USB]  (value not drawn)

### Blocks framed on the sheet
5V LDO REGULATOR: C19 C22 D2 F1 FB1 JJJ1 U7
BUZZER CIRCUIT: BZ1 C23 Q2 R16
SD CARD ADAPTER: C24 J1
3V3 LDO REGULATOR: C25 C26 FB2 U9

### Ports
USB_N, USB_P

### Nets
+3V3: C24.2 C25.2 J1.P4(VDD) U9.5(OUT)
+5V: BZ1.2 C19.2 C20.2 C21.2 C23.2 C26.2 FB2.1 U7.3(VOUT) U8.5(VCC) USB1.A4-B9(VBUS) USB1.B4-A9(VBUS)
GND: C19.1 C20.1 C21.1 C22.1 C23.1 C24.1 C25.1 C26.1 J1.P6(VSS) JJJ1.2 LED2.2 LED3.2 Q2.2(E) Q3.2(S) Q4.2(S) R10.1 R11.1 R19.1 R20.1 R23.1 R24.1 U7.2(GND) U7.4(GND) U8.3(GND) U9.2(GND) USB1.A1-B12(GND) USB1.B1-A12(GND)
VCC: F1.1 JJJ1.1 JJJ2.1 JJJ3.1
BUZZER: R16.1
CH340N_UART_RX: U8.7(RXD)
CH340N_UART_TX: U8.6(TXD)
CS_SDCARD: J1.P2(DAT3/CD)
FÜNYE_DRAG: R14.2 R19.2
FÜNYE_MAIN: R15.2 R20.2
SPI1_MISO_SDCARD: J1.P7(DAT0)
SPI1_MOSI_SDCARD: J1.P3(CMD)
SPI1_SCK_SDCARD: J1.P5(CLK)
TRIG_DRAG: R21.1
TRIG_MAIN: R22.1
USB_N: U8.2(UD-) USB1.A7(DN1) USB1.B7(DN2) ; port USB_N
USB_P: U8.1(UD+) USB1.A6(DP1) USB1.B6(DP2) ; port USB_P
NetBZ1_1: BZ1.1 Q2.3(C)
NetC22_2: C22.2 FB1.2 U7.1(VIN)
NetD2_1: D2.1(CATHODE) FB1.1
NetD2_2: D2.2(ANODE) F1.2
NetFB2_2: FB2.2 U9.1(IN) U9.3(EN)
NetJJJ2_2: JJJ2.2 R12.2
NetJJJ3_2: JJJ3.2 R13.2
NetLED2_1: LED2.1 R17.1
NetLED3_1: LED3.1 R18.1
NetQ2_1: Q2.1(B) R16.2
NetQ3_1: Q3.1(G) R21.2 R23.2
NetQ3_3: Q3.3(D) R12.1 R14.1 R17.2
NetQ4_1: Q4.1(G) R22.2 R24.2
NetQ4_3: Q4.3(D) R13.1 R15.1 R18.2
NetR10_2: R10.2 USB1.A5(CC1)
NetR11_2: R11.2 USB1.B5(CC2)

Not connected (* = marked no-connect by the designer): J1 P1(DAT2) P8(DAT1) P9(CD) SH1(SHIELD) SH2(SHIELD) SH3(SHIELD) SH4(SHIELD); U8 4(RTS)* 8(V3); U9 4(NC)*; USB1 A8(SBU1)* B8(SBU2)* S1(SHELL_GND)* S2(SHELL_GND)* S3(SHELL_GND)* S4(SHELL_GND)*

### Layout directives
differential pair: USB_N, USB_P

### Notes on the sheet
- USB TO UART
- BURDAKİ DIFFERENTIAL 'ların OLMASI GEREKTİĞİNDEN EMİN DEĞİLİM
- (near JJJ1) BATARYA GİRİŞİ
- 5V DC
- ANLADIĞIM KADARIYLA MOSFET TETİKLENDİĞİNDE FÜNYE PATLİCAK
- (near J1) A standard microSD card has an operating voltage of 3.3 V. As a result, we cannot connect it directly to circuits that use 5V logic; in fact, any voltages above 3.6V may permanently damage the microSD card. That is why the module includes an onboard ultra-low dropout voltage regulator capable of regulating voltage to 3.3V.
- LDO regülatör sabit bir voltaj çıkarabilir ve giriş çıkış arasında potansiyel farkın düşük old devrelerde kullanılır.
- CS pini output olarak belirlendi, stm pinlerinde SPI1_NSS / SPI3_NSS / ADC12_IN4 / DAC_OUT1 olarak tanımlanan PA4 pinine atandı.
- (near U9) Datasheet'te EN pininin input voltajıyla aynı olduğu görülüyo
- - Yüksek frekanslı gürültü ve istenmeyen durumlarda, belirlenen frekans aralığının dışında direnç etkisi gösterir, gürültüyü ısı enerjisine çevirerek absorbe ederler. Devrede güç veya sinyal hattına seri bağlanırlar ve alçak geçiren filtre elde edilir.
  - Elektromanyetik ve radyo frekans girşimini azaltır.
  -Kısaca yüksek frekanstaki sinyalleri önleyen pasif bir komponenttir.
  -Bypass kondansatörleri ile ferritler güç bağlantısında beraber kullanılır.

### Library data of the parts
BZ1 = BUZZER: Audio Buzzer Magnetic 3VDC 7VDC 30mA 5VDC 85dB 2600Hz to 2800Hz Through Hole Pin Box; Manufacturer: CUI Devices; Supplier 1: Digi-Key; Manufacturer Part Number: CMI-9605IC-0580T; RoHS: No; Category: Audio Products; Stock 1: 6842; Pricing 1: 1=1,43000, 10=1,19000, 25=1,10160, 50=1,03700, 100=0,97450, 500=0,83848, 1000=0,78382, 5000=0,76810 (USD); Supplier Part Number 1: 2223-CMI-9605IC-0580T-ND
D2 = DIODE: as D1 on sheet Sensors; Supplier 1: Digi-Key; RoHS: Yes; Category: Rectifier Diodes; Stock 1: 973654; Pricing 1: 1=0,21000, 10=0,19200, 100=0,10460, 500=0,06436, 1000=0,04388 (USD); Mount: Surface Mount; Number of Pins: 2; Contact Plating: Tin,Matte; Weight: 0.0276g; Min Operating Temperature: -55°C; Max Operating Temperature: 150°C; Packaging: Tape and Reel; Forward Current: 150mA; Max Repetitive Reverse Voltage (Vrrm): 75V; Package Quantity: 1; Average Rectified Current: 150mA; Max Reverse Voltage (DC): 75V; Recovery Time: 4ns; Series: -; Reverse Voltage: 75V; Length: 1.8mm; Width: 1.35mm; Height: 1mm; Radiation Hardening: No; RoHS Compliant: Yes; Lead Free: Lead Free; Reach SVHC Compliant: Yes; ComponentLink1URL: https://datasheet.ciiva.com/30479/0900766b810e1cd3-30479206.pdf?src-supplier=Rs; ComponentLink1Description: https://datasheet.ciiva.com/30479/0900766b810e1cd3-30479206.pdf?src-supplier=Rs; ComponentLink2URL: https://datasheet.ciiva.com/15208/getdatasheetpartid-127819-15208358.pdf?src-supplier=Verical; ComponentLink2Description: https://datasheet.ciiva.com/15208/getdatasheetpartid-127819-15208358.pdf?src-supplier=Verical; ComponentLink3URL: https://datasheet.ciiva.com/8300/1n914bws-8300360.pdf?src-supplier=Avnet; ComponentLink3Description: https://datasheet.ciiva.com/8300/1n914bws-8300360.pdf?src-supplier=Avnet; ComponentLink4URL: https://datasheet.ciiva.com/910/1n4148ws-910381.pdf?src-supplier=Digi-Key; ComponentLink4Description: https://datasheet.ciiva.com/910/1n4148ws-910381.pdf?src-supplier=Digi-Key; ComponentLink5URL: https://datasheet.ciiva.com/910/1n4148ws-910382.pdf?src-supplier=Digi-Key; ComponentLink5Description: https://datasheet.ciiva.com/910/1n4148ws-910382.pdf?src-supplier=Digi-Key; ComponentLink6URL: https://datasheet.ciiva.com/910/1n4148ws-910380.pdf?src-supplier=Digi-Key; ComponentLink6Description: https://datasheet.ciiva.com/910/1n4148ws-910380.pdf?src-supplier=Digi-Key; Supplier Part Number 1: 1N4148WSFSDKR-ND
F1 = FUSE: Fuse Chip Fast Acting 1A 32V SMD Solder Pad 1206 Glass T/R VDE/cULus; Manufacturer: Schurter; Body Material: Glass,Epoxy; Max Voltage Rating (DC): 63V; DC Cold Resistance: 94.2mR; Fuse Type: Board Mount (Cartridge Style Excluded); Approvals: VDE,cURus; Supplier 1: Digi-Key; Manufacturer Part Number: 3413.0216.22; RoHS: Yes; Category: Fuses; Stock 1: 6832; Pricing 1: 1=0,67000, 50=0,52400, 100=0,39700, 500=0,32624 (USD); Mount: Surface Mount,PCB; Case/Package: 1206; Number of Pins: 2; Weight: 0.000212oz; Case Code (Metric): 3216; Case Code (Imperial): 1206; Contact Plating: Gold; Housing Material: Glass; Terminal Material: Tin; Min Operating Temperature: -55°C; Max Operating Temperature: 90°C; Current Rating: 1A; Package Quantity: 1000; Voltage Rating (AC): 32V; Voltage Rating (DC): 63V; Packaging: Tape and Reel; Max Voltage Rating (AC): 32V; Voltage Rating: 32V; Termination: SMD/SMT; Working Voltage: 32V; Series: USI 1206; Length: 3.2mm; Width: 1.6mm; Height: 0.6mm; Depth: 1.6mm; Radiation Hardening: No; Lead Free: Lead Free; RoHS Compliant: Yes; ComponentLink1URL: https://datasheet.ciiva.com/301/typ-usi-1206-301440.pdf?src-supplier=Digi-Key; ComponentLink1Description: https://datasheet.ciiva.com/301/typ-usi-1206-301440.pdf?src-supplier=Digi-Key; ComponentLink2URL: https://datasheet.ciiva.com/14541/70160006-14541114.pdf?src-supplier=Allied+Electronics; ComponentLink2Description: https://datasheet.ciiva.com/14541/70160006-14541114.pdf?src-supplier=Allied+Electronics; ComponentLink3URL: https://datasheet.ciiva.com/301/typ-usi-1206-301439.pdf?src-supplier=Digi-Key; ComponentLink3Description: https://datasheet.ciiva.com/301/typ-usi-1206-301439.pdf?src-supplier=Digi-Key; ComponentLink4URL: https://datasheet.ciiva.com/301/typ-usi-1206-301441.pdf?src-supplier=Digi-Key; ComponentLink4Description: https://datasheet.ciiva.com/301/typ-usi-1206-301441.pdf?src-supplier=Digi-Key; ComponentLink5URL: https://datasheet.ciiva.com/8264/typ-usi-1206-8264583.pdf?src-supplier=Avnet; ComponentLink5Description: https://datasheet.ciiva.com/8264/typ-usi-1206-8264583.pdf?src-supplier=Avnet; ComponentLink6URL: https://datasheet.ciiva.com/14102/qousi1206-data-e-14102903.pdf?src-supplier=Distrelec; ComponentLink6Description: https://datasheet.ciiva.com/14102/qousi1206-data-e-14102903.pdf?src-supplier=Distrelec; ComponentLink7URL: https://datasheet.ciiva.com/16316/typ-usi-1206-16316588.pdf?src-supplier=Future+Electronics; ComponentLink7Description: https://datasheet.ciiva.com/16316/typ-usi-1206-16316588.pdf?src-supplier=Future+Electronics; Supplier Part Number 1: 486-1144-1-ND
FB1 FB2 = FERRITE BEAD: 0805 600Ω ±25% DCR=0.1Ω 2A; Manufacturer: TDK; Impedance: 600R; DC Resistance (DCR): 100mR; Number of Lines: 1; Supplier 1: Digi-Key; Manufacturer Part Number: MPZ2012S601AT000; RoHS: Yes; Category: Ferrite Beads and Chips; Stock 1: 1942; Pricing 1: 1=0,11000, 10=0,09200, 25=0,08320, 50=0,06100, 100=0,05270, 250=0,04160, 500=0,03512, 1000=0,02957 (USD); Mount: Surface Mount; Case/Package: 0805; Case Code (Metric): 2012; Case Code (Imperial): 0805; Min Operating Temperature: -55°C; Max Operating Temperature: 125°C; Packaging: Tape and Reel; Package Quantity: 1; Current Rating: 2A; Max DC Current: 2A; Series: MPZ; Max Current Rating: 2A; Length: 0.079inch; Width: 0.049inch; Height: 0.041inch; Reach SVHC Compliant: Yes; Lead Free: Lead Free; RoHS Compliant: Yes; ComponentLink1URL: https://datasheet.ciiva.com/46634/beads-commercial-power-mpz-en-46634335.pdf?src-supplier=Digi-Key; ComponentLink1Description: https://datasheet.ciiva.com/46634/beads-commercial-power-mpz-en-46634335.pdf?src-supplier=Digi-Key; ComponentLink2URL: https://datasheet.ciiva.com/46634/beads-commercial-power-mpz-en-46634377.pdf?src-supplier=Digi-Key; ComponentLink2Description: https://datasheet.ciiva.com/46634/beads-commercial-power-mpz-en-46634377.pdf?src-supplier=Digi-Key; ComponentLink3URL: https://datasheet.ciiva.com/46634/beads-commercial-power-mpz-en-46634606.pdf?src-supplier=Digi-Key; ComponentLink3Description: https://datasheet.ciiva.com/46634/beads-commercial-power-mpz-en-46634606.pdf?src-supplier=Digi-Key; Supplier Part Number 1: 445-MPZ2012S601AT000CT-ND
J1 = SD CARD: MEM2075 Series Normally Open SMT Push-Push MicroSD Memory Card Connector; Manufacturer: Global Connector Technology; Supplier 1: Farnell; Manufacturer Part Number: MEM2075-00-140-01-A; RoHS: No; Category: Connectors; Stock 1: 1317; Pricing 1: 1=1,64000, 25=1,55000, 75=1,48000, 200=1,34000, 500=1,24000 (EUR); ComponentLink1URL: https://gct.co/files/drawings/mem2075.pdf?src-supplier=Digi-Key; ComponentLink1Description: https://gct.co/files/drawings/mem2075.pdf?src-supplier=Digi-Key; Supplier Part Number 1: 2895610
JJJ1-JJJ3 = HEADER x2: Conn Screw Type Terminal Block 2 POS 3.5mm Solder ST Thru-Hole 10A; Manufacturer: On-Shore Technology; Manufacturer Part Number: OSTTE020104; Plating: Steel; Number of Levels: 1; Number of Positions Per Level: 2; Voltage: 125V; Pitch: 0.138inch; Wire Gauge (Max): 26AWG; Wire Gauge (Min): 16AWG; Supplier 1: Digi-Key; RoHS: Yes; Category: Terminal Blocks; Stock 1: 73362; Pricing 1: 1=0,74000, 10=0,40200, 25=0,30040, 50=0,26780, 100=0,26260, 250=0,23108, 500=0,21008, 1000=0,18907, 5000=0,14180 (USD); Mount: Through Hole; Number of Pins: 2; Contact Plating: Tin; Color: Black; Housing Material: Thermoplastic; Min Operating Temperature: -30°C; Max Operating Temperature: 105°C; Current: 10A; Termination: Screw; Packaging: Bulk; ComponentLink1URL: http://www.on-shore.com/wp-content/uploads/2015/09/osttexx0164.pdf?src-supplier=Digi-Key; ComponentLink1Description: http://www.on-shore.com/wp-content/uploads/2015/09/osttexx0164.pdf?src-supplier=Digi-Key; ComponentLink2URL: http://www.on-shore.com/wp-content/uploads/2015/09/osttexx0164.pdf?src-supplier=Verical; ComponentLink2Description: http://www.on-shore.com/wp-content/uploads/2015/09/osttexx0164.pdf?src-supplier=Verical; ComponentLink3URL: http://www.on-shore.com/wp-content/uploads/2015/09/osttexx0164.pdf?src-supplier=Arrow+Electronics; ComponentLink3Description: http://www.on-shore.com/wp-content/uploads/2015/09/osttexx0164.pdf?src-supplier=Arrow+Electronics; Supplier Part Number 1: ED2740-ND
LED2 LED3 = LED RED: as LED1 on sheet Sensors; Supplier 1: Digi-Key; Manufacturer Part Number: CMD17-21VRD/TR8; RoHS: Yes; Category: LEDs; Stock 1: 357228; Pricing 1: 1=0,73000, 10=0,47800, 100=0,31310, 1000=0,24720 (USD); Mount: Surface Mount; Case/Package: 0805; Number of Pins: 2; Color: Red; Case Code (Metric): 2012; Case Code (Imperial): 0805; Lens Color: Red; Min Operating Temperature: -40°C; Max Operating Temperature: 85°C; Packaging: Tape and Reel; Package Quantity: 1; Illumination Color: Red; Test Current: 20mA; Wavelength: 640nm; Reverse Voltage: 5V; Length: 2mm; Width: 1.25mm; Height: 1.1mm; RoHS Compliant: Yes; Lead Free: Lead Free; ComponentLink1URL: http://www.mouser.com/ds/2/423/CMD1721ver1-1064576.pdf?src-supplier=Mouser; ComponentLink1Description: http://www.mouser.com/ds/2/423/CMD1721ver1-1064576.pdf?src-supplier=Mouser; ComponentLink2URL: https://www.alliedelec.com/m/d/ea8f758becbd32522d2612194452bcae.pdf?src-supplier=Allied+Electronics; ComponentLink2Description: https://www.alliedelec.com/m/d/ea8f758becbd32522d2612194452bcae.pdf?src-supplier=Allied+Electronics; ComponentLink3URL: http://www.onlinecomponents.com/productFiles/mf-CM/2cmd17-21seriessmtleds0805packagesize.pdf?src-supplier=Onlinecomponents.com; ComponentLink3Description: http://www.onlinecomponents.com/productFiles/mf-CM/2cmd17-21seriessmtleds0805packagesize.pdf?src-supplier=Onlinecomponents.com; ComponentLink4URL: https://vcclite.com/wp-content/uploads/wpallimport/files/files/CMD1721Seriesver3.pdf?src-supplier=Digi-Key; ComponentLink4Description: https://vcclite.com/wp-content/uploads/wpallimport/files/files/CMD1721Seriesver3.pdf?src-supplier=Digi-Key; Supplier Part Number 1: L62501CT-ND
Q2 = BJT_NPN: as Q1 on sheet Sensors; Supplier 1: Digi-Key; Manufacturer Part Number: MMBT3904-7-F; RoHS: Yes; Category: BJTs; Stock 1: 7729144; Pricing 1: 1=0,13000, 10=0,11700, 100=0,06370, 500=0,03918, 1000=0,02671 (USD); Mount: Surface Mount; Case/Package: SOT-23; Number of Pins: 3; Weight: 0.000282oz; Contact Plating: Tin,Matte; Min Operating Temperature: -55°C; Max Operating Temperature: 150°C; Polarity: NPN; Packaging: Tape and Reel; Package Quantity: 3000; Transition Frequency: 300MHz; Collector Emitter Breakdown Voltage: 40V; Max Breakdown Voltage: 40V; Continuous Collector Current: 200mA; Max Frequency: 300MHz; Gain Bandwidth Product: 300MHz; Voltage Rating (DC): 40V; Series: Automotive, AEC-Q101; Collector-emitter Voltage-Max: 300mV; Length: 3.05mm; Width: 1.4mm; Height: 1mm; Radiation Hardening: No; Reach SVHC Compliant: Yes; Lead Free: Lead Free; RoHS Compliant: Yes; ComponentLink1URL: https://datasheet.ciiva.com/11201/ds30036-11201778.pdf?src-supplier=Avnet; ComponentLink1Description: https://datasheet.ciiva.com/11201/ds30036-11201778.pdf?src-supplier=Avnet; ComponentLink2URL: https://datasheet.ciiva.com/15138/getdatasheetpartid-53265-15138780.pdf?src-supplier=Verical; ComponentLink2Description: https://datasheet.ciiva.com/15138/getdatasheetpartid-53265-15138780.pdf?src-supplier=Verical; ComponentLink3URL: https://datasheet.ciiva.com/22711/1915516-22711750.pdf?src-supplier=Element14; ComponentLink3Description: https://datasheet.ciiva.com/22711/1915516-22711750.pdf?src-supplier=Element14; ComponentLink4URL: https://datasheet.ciiva.com/11198/ds30036-11198999.pdf?src-supplier=Avnet; ComponentLink4Description: https://datasheet.ciiva.com/11198/ds30036-11198999.pdf?src-supplier=Avnet; ComponentLink5URL: https://datasheet.ciiva.com/6361/ds30036-6361256.pdf?src-supplier=Digi-Key; ComponentLink5Description: https://datasheet.ciiva.com/6361/ds30036-6361256.pdf?src-supplier=Digi-Key; ComponentLink6URL: https://datasheet.ciiva.com/6361/ds30036-6361254.pdf?src-supplier=Digi-Key; ComponentLink6Description: https://datasheet.ciiva.com/6361/ds30036-6361254.pdf?src-supplier=Digi-Key; Supplier Part Number 1: MMBT3904-FDICT-ND
Q3 Q4 = MOSFET N-Channel: MOSFET N-CH 60V 0.26A SOT23; Manufacturer: ON Semiconductor; Continuous Drain Current (ID): 310mA; Rds On Max: 2.5R; Input Capacitance: 40pF; Max Power Dissipation: 300mW; Number of Channels: 1; Drain to Source Resistance: 1R; Gate to Source Voltage (Vgs): 30V; Fall Time: 3.6ns; Rise Time: 1.2ns; Turn-Off Delay Time: 4.8ns; Turn-On Delay Time: 1.7ns; FET Type: 1 N-Channel; Supplier 1: Digi-Key; Manufacturer Part Number: NTR5103NT1G; RoHS: Yes; Category: MOSFETs; Stock 1: 55356; Pricing 1: 1=0,25000, 10=0,20100, 100=0,10660, 500=0,07012, 1000=0,04768 (USD); Mount: Surface Mount; Case/Package: SOT-23-3; Number of Pins: 3; Contact Plating: Tin; Min Operating Temperature: -55°C; Max Operating Temperature: 150°C; Packaging: Tape and Reel; Drain to Source Voltage (Vdss): 60V; Drain to Source Breakdown Voltage: 60V; Package Quantity: 3000; Lead Free: Lead Free; RoHS Compliant: Yes; ComponentLink1URL: http://www.farnell.com/datasheets/2237046.pdf?src-supplier=Farnell; ComponentLink1Description: http://www.farnell.com/datasheets/2237046.pdf?src-supplier=Farnell; ComponentLink2URL: http://www.mouser.com/ds/2/308/NTR5103N-D-600006.pdf?src-supplier=Mouser; ComponentLink2Description: http://www.mouser.com/ds/2/308/NTR5103N-D-600006.pdf?src-supplier=Mouser; ComponentLink3URL: http://www.farnell.com/datasheets/2237046.pdf?src-supplier=Newark; ComponentLink3Description: http://www.farnell.com/datasheets/2237046.pdf?src-supplier=Newark; ComponentLink4URL: http://www.farnell.com/datasheets/2237046.pdf?src-supplier=Element14; ComponentLink4Description: http://www.farnell.com/datasheets/2237046.pdf?src-supplier=Element14; ComponentLink5URL: http://www.onsemi.com/pub/Collateral/NTR5103N-D.PDF?src-supplier=Avnet; ComponentLink5Description: http://www.onsemi.com/pub/Collateral/NTR5103N-D.PDF?src-supplier=Avnet; ComponentLink6URL: http://www.onsemi.com/pub/Collateral/NTR5103N-D.PDF?src-supplier=Digi-Key; ComponentLink6Description: http://www.onsemi.com/pub/Collateral/NTR5103N-D.PDF?src-supplier=Digi-Key; Supplier Part Number 1: NTR5103NT1GOSCT-ND
U7 = MCP1825S-5002E/DB: IC; Linear Regulator; Max. Input; 6V; Output; 5V; 500MA; Accuracy; 0.5%; SOT223-3; Manufacturer: Microchip; Dropout Voltage: 210mV; Min Input Voltage: 2.1V; Number of Outputs: 1; Input Bias Current: 120uA; Quiescent Current: 220uA; Polarity: Positive; Output Type: Fixed; Supplier 1: Digi-Key; Manufacturer Part Number: MCP1825S-5002E/DB; RoHS: Yes; Category: Voltage Regulators - Linear; Stock 1: 2498; Pricing 1: 1=0,69000, 25=0,58320, 100=0,53000 (USD); Mount: Surface Mount; Case/Package: SOT-223; Number of Pins: 3; Min Operating Temperature: -40°C; Max Operating Temperature: 125°C; Package Quantity: 78; Max Input Voltage: 6V; Output Current: 500mA; Output Voltage: 5V; Packaging: Rail/Tube; Max Output Current: 500mA; Min Output Voltage: 5V; Accuracy: 0.5%; Nominal Output Voltage: 5V; Output Voltage Accuracy: 0.5%; Length: 6.5mm; Width: 3.5mm; Height: 1.6mm; Radiation Hardening: No; Reach SVHC Compliant: Yes; Lead Free: Lead Free; RoHS Compliant: Yes; ComponentLink1URL: https://datasheet.ciiva.com/41458/001085970-da-01-en-ic-reg-l-mcp1825s-5002e-db-sot-223-3-mcp-41458813.pdf?src-supplier=Conrad; ComponentLink1Description: https://datasheet.ciiva.com/41458/001085970-da-01-en-ic-reg-l-mcp1825s-5002e-db-sot-223-3-mcp-41458813.pdf?src-supplier=Conrad; ComponentLink2URL: https://datasheet.ciiva.com/8041/514217-8041503.pdf?src-supplier=Element14; ComponentLink2Description: https://datasheet.ciiva.com/8041/514217-8041503.pdf?src-supplier=Element14; ComponentLink3URL: https://datasheet.ciiva.com/8239/22056b-8239274.pdf?src-supplier=Avnet; ComponentLink3Description: https://datasheet.ciiva.com/8239/22056b-8239274.pdf?src-supplier=Avnet; ComponentLink4URL: https://datasheet.ciiva.com/16298/filehandler-aspxddocname-en531698-16298391.pdf?src-supplier=Future+Electronics; ComponentLink4Description: https://datasheet.ciiva.com/16298/filehandler-aspxddocname-en531698-16298391.pdf?src-supplier=Future+Electronics; ComponentLink5URL: https://datasheet.ciiva.com/15200/getdatasheetpartid-567689-15200326.pdf?src-supplier=Verical; ComponentLink5Description: https://datasheet.ciiva.com/15200/getdatasheetpartid-567689-15200326.pdf?src-supplier=Verical; ComponentLink6URL: https://datasheet.ciiva.com/2051/22056b-2051733.pdf?src-supplier=Digi-Key; ComponentLink6Description: https://datasheet.ciiva.com/2051/22056b-2051733.pdf?src-supplier=Digi-Key; Supplier Part Number 1: MCP1825S-5002E/DB-ND
U8 = CH340N: USB TO UART TTL CONVERTER - SOP 8 PACKAGE
U9 = NCP161ASN330T1G: LDO Regulator, 450 mA, Ultra-High PSRR, Ultra-Low Noise 3.3V, SOT23-5L, Active Discharge; Manufacturer: ON Semiconductor; Voltage - Input (Max): 5.5V; Current - Output: 450mA; Supplier 1: Digi-Key; Manufacturer Part Number: NCP161ASN330T1G; RoHS: Yes; Category: Voltage Regulators - Linear; Stock 1: 4959; Pricing 1: 1=0,67000, 10=0,58900, 25=0,55320, 100=0,45160, 250=0,41948, 500=0,35700, 1000=0,28561 (USD); RoHS Compliant: Yes; ComponentLink1URL: http://www.farnell.com/datasheets/2815754.pdf?src-supplier=Farnell; ComponentLink1Description: http://www.farnell.com/datasheets/2815754.pdf?src-supplier=Farnell; Supplier Part Number 1: NCP161ASN330T1GOSCT-ND; Voltage - Output (Min/Fixed): 3.3V; Supplier Device Package: SOT-23-5
USB1 = TYPE C USB CONNECTOR: USB Connector with 1.90mm shell stake length; Manufacturer: Global Connector Technology; Manufacturer Part Number: USB4125-GF-A-0190; Supplier 1: Farnell; RoHS: No; Category: USB Connectors; Stock 1: 2000; Pricing 1: 1000=0,40500, 5000=0,39700, 10000=0,38900, 20000=0,38100 (EUR); Supplier Part Number 1: 3777666

## Nets that join several sheets
+3V3: Sensors (18 pins), Mcu (9 pins), Power (C24.2 C25.2 J1.P4 U9.5)
GND: Sensors (33 pins), Mcu (17 pins), Power (27 pins)
BME280_SCL: Sensors (R1.1 U1.4), Mcu (U6.47)
BME280_SDA: Sensors (R2.1 U1.3), Mcu (U6.48)
BUZZER: Mcu (U6.59), Power (R16.1)
CH340N_UART_RX: Mcu (U6.23), Power (U8.7)
CH340N_UART_TX: Mcu (U6.24), Power (U8.6)
CS_SDCARD: Mcu (U6.29), Power (J1.P2)
FÜNYE_DRAG: Mcu (U6.35), Power (R14.2 R19.2)
FÜNYE_MAIN: Mcu (U6.36), Power (R15.2 R20.2)
GPS_UART_RX: Sensors (U4.21), Mcu (U6.56)
GPS_UART_TX: Sensors (U4.20), Mcu (U6.55)
LORA_BUSY: Sensors (U3.14), Mcu (U6.39)
LORA_DIO1: Sensors (U3.13), Mcu (U6.41)
LORA_DIO2: Sensors (U3.8), Mcu (U6.42)
LORA_MISO: Sensors (U3.16), Mcu (U6.2)
LORA_MOSI: Sensors (U3.17), Mcu (U6.1)
LORA_NSS: Sensors (U3.19), Mcu (U6.4)
LORA_RST: Sensors (U3.15), Mcu (U6.97)
LORA_SCK: Sensors (U3.18), Mcu (U6.3)
LORA_UART_RX: Sensors (U3.6), Mcu (U6.83)
LORA_UART_TX: Sensors (U3.7), Mcu (U6.80)
MPU6050_SCL: Sensors (U2.23), Mcu (U6.92)
MPU6050_SDA: Sensors (U2.24), Mcu (U6.93)
SPI1_MISO_SDCARD: Mcu (U6.31), Power (J1.P7)
SPI1_MOSI_SDCARD: Mcu (U6.32), Power (J1.P3)
SPI1_SCK_SDCARD: Mcu (U6.30), Power (J1.P5)
TRIG_DRAG: Mcu (U6.33), Power (R21.1)
TRIG_MAIN: Mcu (U6.34), Power (R22.1)
USB_N: Mcu (R8.2 U5.1 U5.6), Power (U8.2 USB1.A7 USB1.B7)
USB_P: Mcu (R7.2 U5.3 U5.4), Power (U8.1 USB1.A6 USB1.B6)